# EAGLE schematic ArduinoMicro (EAGLE 9.2.2)
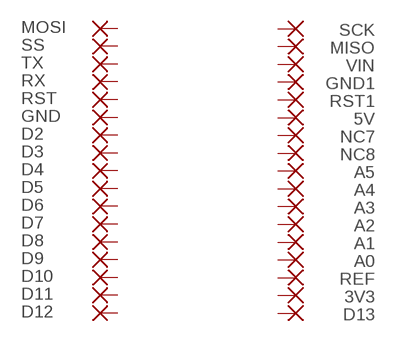
[diagram p0: schematic, sheet 1]

## Parts
3V3  1,6/0,9  [1,6/0,9]
5V  1,6/0,9  [1,6/0,9]
A0  1,6/0,9  [1,6/0,9]
A1  1,6/0,9  [1,6/0,9]
A2  1,6/0,9  [1,6/0,9]
A3  1,6/0,9  [1,6/0,9]
A4  1,6/0,9  [1,6/0,9]
A5  1,6/0,9  [1,6/0,9]
D2  1,6/0,9  [1,6/0,9]
D3  1,6/0,9  [1,6/0,9]
D4  1,6/0,9  [1,6/0,9]
D5  1,6/0,9  [1,6/0,9]
D6  1,6/0,9  [1,6/0,9]
D7  1,6/0,9  [1,6/0,9]
D8  1,6/0,9  [1,6/0,9]
D9  1,6/0,9  [1,6/0,9]
D10  1,6/0,9  [1,6/0,9]
D11  1,6/0,9  [1,6/0,9]
D12  1,6/0,9  [1,6/0,9]
D13  1,6/0,9  [1,6/0,9]
GND  1,6/0,9  [1,6/0,9]
GND1  1,6/0,9  [1,6/0,9]
MISO  1,6/0,9  [1,6/0,9]
MOSI  1,6/0,9  [1,6/0,9]
NC7  1,6/0,9  [1,6/0,9]
NC8  1,6/0,9  [1,6/0,9]
REF  1,6/0,9  [1,6/0,9]
RST  1,6/0,9  [1,6/0,9]
RST1  1,6/0,9  [1,6/0,9]
RX  1,6/0,9  [1,6/0,9]
SCK  1,6/0,9  [1,6/0,9]
SS  1,6/0,9  [1,6/0,9]
TX  1,6/0,9  [1,6/0,9]
VIN  1,6/0,9  [1,6/0,9]
Unconnected: 3V3.1(P) 5V.1(P) A0.1(P) A1.1(P) A2.1(P) A3.1(P) A4.1(P) A5.1(P) D2.1(P) D3.1(P) D4.1(P) D5.1(P) D6.1(P) D7.1(P) D8.1(P) D9.1(P) D10.1(P) D11.1(P) D12.1(P) D13.1(P) GND1.1(P) GND.1(P) MISO.1(P) MOSI.1(P) NC7.1(P) NC8.1(P) REF.1(P) RST1.1(P) RST.1(P) RX.1(P) SCK.1(P) SS.1(P) TX.1(P) VIN.1(P)

## Library data of the parts
3V3 5V A0 A1-A5 D2-D13 GND GND1 MISO MOSI NC7 NC8 REF RST RST1 RX SCK SS TX VIN = wirepad:1,6/0,9: THROUGH-HOLE PAD